# Altium schematic sheet CurrentSensor.SchDoc
size A
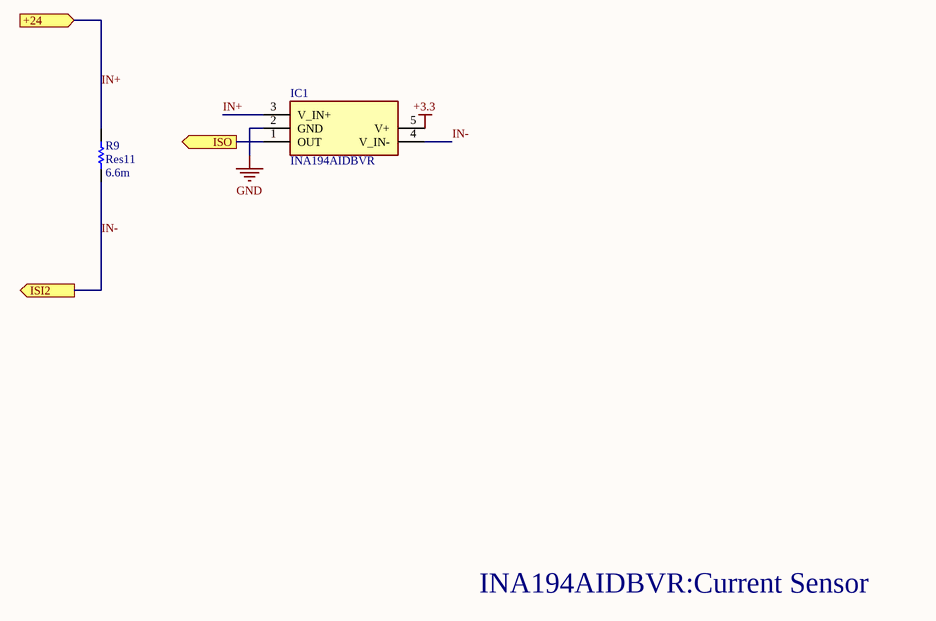
[diagram p0: CurrentSensor.SchDoc]

## Parts
IC1  INA194AIDBVR  [SOT95P280X145-5N]
R9  Res11  value 6.6m  [0402]

## Ports
+24 (in), ISI2 (out), ISO (out)

## Nets
+3.3: IC1.5(V+)
GND: IC1.2(GND)
IN+: IC1.3(V_IN+) R9.2 ; port +24
IN-: IC1.4(V_IN-) R9.1 ; port ISI2
ISO: IC1.1(OUT) ; port ISO

## Notes on the sheet
- INA194AIDBVR:Current Sensor

## Library data of the parts
IC1 = INA194AIDBVR: Integrated Circuit; Manufacturer_Name: Texas Instruments; Datasheet Link: http://www.ti.com/lit/gpn/ina194; Height: 1.45mm; Manufacturer_Part_Number: INA194AIDBVR; Mouser Part Number: 595-INA194AIDBVR; Mouser Price/Stock: https://www.mouser.com/Search/Refine.aspx?Keyword=595-INA194AIDBVR
R9 = Res1: Resistor; Published: 8-Jun-2000; LatestRevisionDate: 17-Jul-2002; LatestRevisionNote: Re-released for DXP Platform.; PackageReference: AXIAL-0.3; Publisher: Altium Limited; PackageDescription: Axial Device, Thru-Hole; 2 Leads; 0.3 in Pin Spacing